# Altium schematic sheet Power.SchDoc
size A4; CompanyName: NTNU; DrawnBy: GT
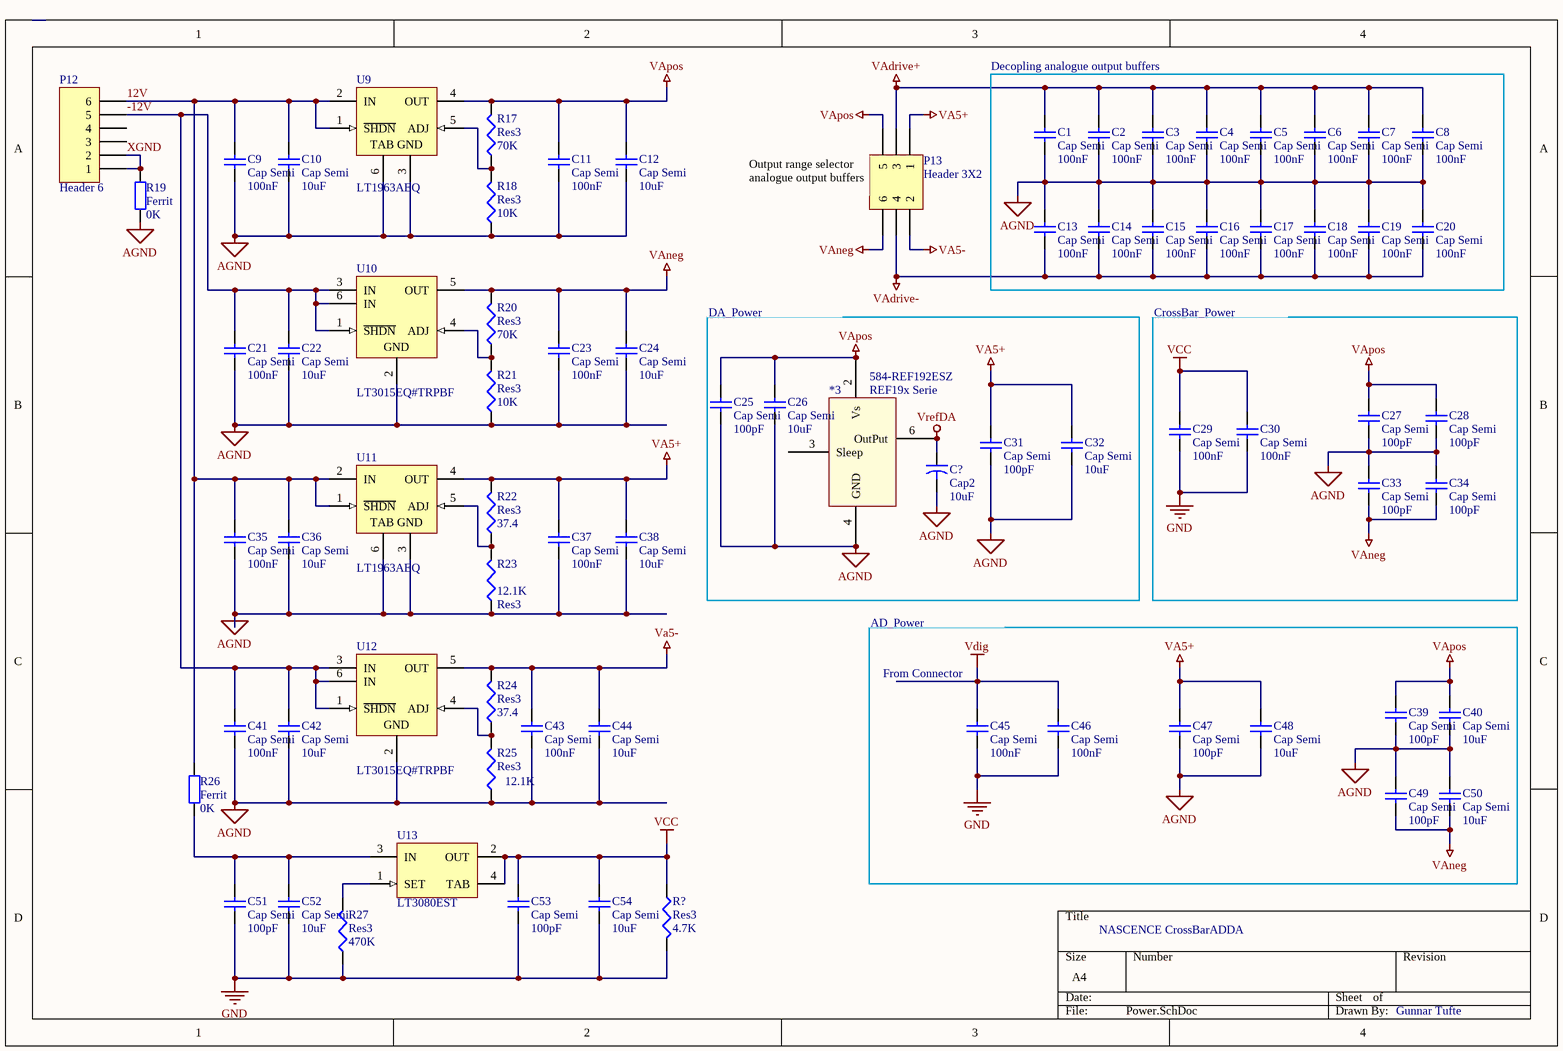
[diagram p0: Power.SchDoc]

## Parts
*3  REF19x Serie  Supplier Part Number 1: 584-REF192ESZ  [SOIC127P600-8M]
C1  Cap Semi  value 100nF  [C1206]
C2  Cap Semi  value 100nF  [C1206]
C3  Cap Semi  value 100nF  [C1206]
C4  Cap Semi  value 100nF  [C1206]
C5  Cap Semi  value 100nF  [C1206]
C6  Cap Semi  value 100nF  [C1206]
C7  Cap Semi  value 100nF  [C1206]
C8  Cap Semi  value 100nF  [C1206]
C9  Cap Semi  value 100nF  [C1206]
C10  Cap Semi  value 10uF  [C1206]
C11  Cap Semi  value 100nF  [C1206]
C12  Cap Semi  value 10uF  [C1206]
C13  Cap Semi  value 100nF  [C1206]
C14  Cap Semi  value 100nF  [C1206]
C15  Cap Semi  value 100nF  [C1206]
C16  Cap Semi  value 100nF  [C1206]
C17  Cap Semi  value 100nF  [C1206]
C18  Cap Semi  value 100nF  [C1206]
C19  Cap Semi  value 100nF  [C1206]
C20  Cap Semi  value 100nF  [C1206]
C21  Cap Semi  value 100nF  [C1206]
C22  Cap Semi  value 10uF  [C1206]
C23  Cap Semi  value 100nF  [C1206]
C24  Cap Semi  value 10uF  [C1206]
C25  Cap Semi  value 100pF  [C1206]
C26  Cap Semi  value 10uF  [C1206]
C27  Cap Semi  value 100pF  [C1206]
C28  Cap Semi  value 100pF  [C1206]
C29  Cap Semi  value 100nF  [C1206]
C30  Cap Semi  value 100nF  [C1206]
C31  Cap Semi  value 100pF  [C1206]
C32  Cap Semi  value 10uF  [C1206]
C33  Cap Semi  value 100pF  [C1206]
C34  Cap Semi  value 100pF  [C1206]
C35  Cap Semi  value 100nF  [C1206]
C36  Cap Semi  value 10uF  [C1206]
C37  Cap Semi  value 100nF  [C1206]
C38  Cap Semi  value 10uF  [C1206]
C39  Cap Semi  value 100pF  [C1206]
C40  Cap Semi  value 10uF  [C1206]
C41  Cap Semi  value 100nF  [C1206]
C42  Cap Semi  value 10uF  [C1206]
C43  Cap Semi  value 100nF  [C1206]
C44  Cap Semi  value 10uF  [C1206]
C45  Cap Semi  value 100nF  [C1206]
C46  Cap Semi  value 100nF  [C1206]
C47  Cap Semi  value 100pF  [C1206]
C48  Cap Semi  value 10uF  [C1206]
C49  Cap Semi  value 100pF  [C1206]
C50  Cap Semi  value 10uF  [C1206]
C51  Cap Semi  value 100pF  [C1206]
C52  Cap Semi  value 10uF  [C1206]
C53  Cap Semi  value 100pF  [C1206]
C54  Cap Semi  value 10uF  [C1206]
C?  Cap2  value 10uF  [CAPR5-4X5]
P12  Header 6  [HDR1X6]
P13  Header 3X2  [HDR2X3]
R17  Res3  value 70K  [14-1210]
R18  Res3  value 10K  [14-1210]
R19  Ferrit  value 0K  [AXIAL-0.4]
R20  Res3  value 70K  [14-1210]
R21  Res3  value 10K  [14-1210]
R22  Res3  value 37.4  [14-1210]
R23  Res3  value 12.1K  [14-1210]
R24  Res3  value 37.4  [14-1210]
R25  Res3  value 12.1K  [14-1210]
R26  Ferrit  value 0K  [AXIAL-0.4]
R27  Res3  value 470K  [14-1210]
R?  Res3  value 4.7K  [14-1210]
U9  LT1963AEQ  [LT-Q-5_N]
U10  LT3015EQ#TRPBF  [LT-Q-5_N]
U11  LT1963AEQ  [LT-Q-5_N]
U12  LT3015EQ#TRPBF  [LT-Q-5_N]
U13  LT3080EST  [LT-ST-3-SOT-223_N]

## Blocks framed on the sheet
Decopling analogue output buffers: C1-C8 C13-C20

## Nets
AGND: *3.4(GND) C1.2 C2.2 C3.1 C4.1 C5.1 C6.1 C7.1 C8.1 C9.1 C10.1 C11.1 C12.1 C13.2 C14.2 C15.2 C16.2 C17.2 C18.2 C19.2 C20.2 C21.1 C22.1 C23.1 C24.1 C25.1 C26.1 C27.1 C28.1 C31.1 C32.1 C33.2 C34.2 C35.1 C36.1 C37.1 C38.1 C39.1 C40.1 C41.1 C42.1 C43.1 C44.1 C47.2 C48.2 C49.2 C50.2 C?.2 R18.1 R19.1 R21.1 R23.1 R25.1 U9.3(GND) U9.6(TAB) U10.2(GND) U11.3(GND) U11.6(TAB) U12.2(GND)
GND: C29.1 C30.1 C45.1 C46.1 C51.2 C52.2 C53.2 C54.2 R27.1 R?.2
VA5+: C31.2 C32.2 C37.2 C38.2 C47.1 C48.1 P13.1 R22.2 U11.4(OUT)
VA5-: C43.2 C44.2 P13.2 R24.2 U12.5(OUT)
VAdrive+: C1.1 C2.1 C3.2 C4.2 C5.2 C6.2 C7.2 C8.2 P13.3
VAdrive-: C13.1 C14.1 C15.1 C16.1 C17.1 C18.1 C19.1 C20.1 P13.4
VAneg: C23.2 C24.2 C33.1 C34.1 C49.1 C50.1 P13.6 R20.2 U10.5(OUT)
VApos: *3.2(Vs) C11.2 C12.2 C25.2 C26.2 C27.2 C28.2 C39.2 C40.2 P13.5 R17.2 U9.4(OUT)
VCC: C29.2 C30.2 C53.1 C54.1 R?.1 U13.2(OUT) U13.4(TAB)
Vdig: C45.2 C46.2
VrefDA: *3.6(OutPut) C?.1
12V: C9.2 C10.2 C35.2 C36.2 P12.6 R26.2 U9.1(~{SHDN}) U9.2(IN) U11.1(~{SHDN}) U11.2(IN)
-12V: C21.2 C22.2 C41.2 C42.2 P12.5 U10.1(~{SHDN}) U10.3(IN) U10.6(IN) U12.1(~{SHDN}) U12.3(IN) U12.6(IN)
XGND: P12.1 P12.2 R19.2
NetC51_1: C51.1 C52.1 R26.1 U13.3(IN)
NetR17_1: R17.1 R18.2 U9.5(ADJ)
NetR20_1: R20.1 R21.2 U10.4(ADJ)
NetR22_1: R22.1 R23.2 U11.5(ADJ)
NetR24_1: R24.1 R25.2 U12.4(ADJ)
NetR27_2: R27.2 U13.1(SET)

Not connected (* = marked no-connect by the designer): *3 1(TP) 3(Sleep) 5(TP) 7(NC) 8(NC); P12 3 4

## Notes on the sheet
- (near P13) Output range selector
  analogue output buffers
- DA_Power
- CrossBar_Power
- AD_Power
- (near C45) From Connector
- NASCENCE CrossBarADDA
- Gunnar Tufte

## Library data of the parts
C1-C54 = Cap Semi: Capacitor (Semiconductor SIM Model); Published: 8-Jun-2000; LatestRevisionDate: 29-May-2009; LatestRevisionNote: IPC-7351 Footprint Added.; PackageReference: C1206; Publisher: Altium Limited; PackageDescription: Chip Capacitor
C? = Cap2: Capacitor; Published: 23-Sep-2002; PackageReference: CAPR5-4X5; Publisher: Altium Limited; PackageDescription: Capacitor; 2 Leads
P12 = Header 6: Header, 6-Pin; LatestRevisionDate: 17-Jul-2002; LatestRevisionNote: Re-released for DXP Platform.; Publisher: Altium Limited
P13 = Header 3X2: Header, 3-Pin, Dual row; LatestRevisionDate: 17-Jul-2002; LatestRevisionNote: Re-released for DXP Platform.; Publisher: Altium Limited
R17 R18 R20-R25 R27 R? = Res3: Resistor; Published: 8-Jun-2000; LatestRevisionDate: 29-May-2009; LatestRevisionNote: IPC-7351 Footprint Added.; PackageReference: J1-0603; Publisher: Altium Limited; PackageDescription: Chip Resistor
R19 R26 = Res2: Resistor; Published: 8-Jun-2000; LatestRevisionDate: 17-Jul-2002; LatestRevisionNote: Re-released for DXP Platform.; PackageReference: AXIAL-0.4; Publisher: Altium Limited; PackageDescription: Axial Device, Thru-Hole; 2 Leads; 0.4 in Pin Spacing
U9 U11 = LT1963AEQ: 1.5 A, Low Noise, Fast Transient Response LDO Regulator, 2.1 to 20 V Vin, Adjustable Vout, 5-pin DPAK (Q-5), -40 to 125 degC; Manufacturer: Linear Technology; Discrete Pass Element: no; Dropout Voltage(V): 0.34; Iout(mA): 1500; Isupply(mA): 1; Noise(uV): 40; Output Voltage: Adj; PSRR(dB): 63; Shutdown Current(uA): 0.01; Vin Max(V): 20; Vin Min(V): 2.1; Vout Min(V): 1.21; DatasheetVersion: Rev. E; PackageVersion: Rev. F, 09/2011; PackageReference: Q-5; PackageDescription: 5-Pin Plastic DD Pak, Body 10.2235 x 8.89 mm, Pitch 1.702 mm; Supplier 1: Digi-Key; Supplier Part Number 1: LT1963AEQ-ND; Supplier 2: Newark; Supplier Part Number 2: 57M7427; Number of Outputs: 1; RoHS: FALSE; Vout Max(V): 20; Mounting Technology: Surface Mount; PartNumber: LT1963AEQ; ComponentLink1Description: Manufacturer URL; ComponentLink1URL: http://www.linear.com/; ComponentLink2Description: Datasheet; ComponentLink2URL: http://cds.linear.com/docs/en/datasheet/1963afe.pdf; ComponentLink3Description: Package Specification; ComponentLink3URL: http://cds.linear.com/docs/en/packaging/Q%20DD5%2005-08-1461%20Rev%20F.pdf
U10 U12 = LT3015EQ#TRPBF: 1.5 A, Low Noise, Negative Linear Regulator with Precision Current Limit, -1.8 to -30 V Vin, Adjustable Vout, 5-pin DPAK (Q-5), -40 to 125 degC, Pb-Free, Tape and Reel; Manufacturer: Linear Technology; Discrete Pass Element: no; Dropout Voltage(V): 0.31; Iout(mA): 1500; Isupply(mA): 1.1; Noise(uV): 60; Number of Outputs: 1; Output Voltage: Adj; PSRR(dB): 65; Shutdown Current(uA): 17; Vout Max(V): -1.22; Vout Min(V): -29.3; DatasheetVersion: Rev. B; PackageVersion: Rev. F, 09/2011; PackageReference: Q-5; PackageDescription: 5-Pin Plastic DD Pak, Body 10.2235 x 8.89 mm, Pitch 1.702 mm; Supplier 1: Digi-Key; Supplier Part Number 1: LT3015EQ#TRPBF-ND; Supplier 2: Newark; Supplier Part Number 2: 59T5799; Packing: Tape and Reel; RoHS: TRUE; Vin Max(V): -1.8; Vin Min(V): -30; Mounting Technology: Surface Mount; PartNumber: LT3015EQ#TRPBF; ComponentLink1Description: Manufacturer URL; ComponentLink1URL: http://www.linear.com/; ComponentLink2Description: Datasheet; ComponentLink2URL: http://cds.linear.com/docs/en/datasheet/3015fb.pdf; ComponentLink3Description: Package Specification; ComponentLink3URL: http://cds.linear.com/docs/en/packaging/Q%20DD5%2005-08-1461%20Rev%20F.pdf
U13 = LT3080EST: Adjustable 1.1 A Single Resistor Low Dropout Regulator, 0.3 mA Isupply, 3-pin SOT223 (ST-3), -40 to 125 degC; Manufacturer: Linear Technology; Extended Temp: E, I; Initial Accuracy(%): 1; Isupply(mA): 0.3; Vin Max(V): 36; Vin Min(V): 1.2; DatasheetVersion: Rev. F; PackageVersion: Jun-10; PackageReference: ST-3; PackageDescription: 3-Pin Plastic SOT-223, Body 3.505 x 6.505 mm, Pitch 2.3 mm; RoHS: FALSE; Mounting Technology: Surface Mount; PartNumber: LT3080EST; ComponentLink1Description: Manufacturer URL; ComponentLink1URL: http://www.linear.com/; ComponentLink2Description: Datasheet; ComponentLink2URL: http://cds.linear.com/docs/en/datasheet/3080fc.pdf; ComponentLink3Description: Package Specification; ComponentLink3URL: http://cds.linear.com/docs/en/packaging/SOT_3_05-08-1630.pdf
*3 = REF19x Serie: Supplier 1: Mouser